# Altium schematic sheet VOLTAJE.SchDoc
size A
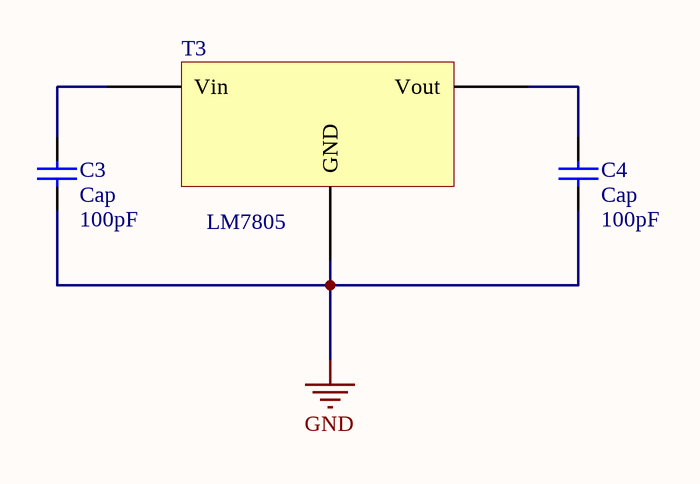
[diagram p0: VOLTAJE.SchDoc]

## Parts
C3  Cap  value 100pF  [RAD-0.3]
C4  Cap  value 100pF  [RAD-0.3]
T3  LM7805  [LM7805]

## Nets
GND: C3.1 C4.1 T3.174(GND)
NetC3_2: C3.2 T3.173(Vin)
NetC4_2: C4.2 T3.175(Vout)

## Library data of the parts
C3 C4 = Cap: Capacitor Ceramico; Manufacturer: KEMET; Manufacturer Part Number: C0402C104K8PACTU; Capacitance: 100nF; Tolerance: 10%; Voltage Rating: 10V; Dielectric: X5R; Dissipation Factor: 5%; Published: 8-Jun-2000; LatestRevisionDate: 17-Jul-2002; LatestRevisionNote: Re-released for DXP Platform.; PackageReference: RAD-0.3; Publisher: Altium Limited; PackageDescription: Radial Cap, Thru-Hole; 2 Leads; 0.3 in Pin Spacing; Supplier 1: Arrow; Stock 1: 0; Mount: PCB,Surface Mount; Case/Package: 0402; Number of Pins: 2; Case Code (Metric): 1005; Case Code (Imperial): 0402; Dielectric Material: Ceramic; Contact Plating: Matte,Tin; Min Operating Temperature: -55°C; Max Operating Temperature: 85°C; Voltage Rating (DC): 10V; Package Quantity: 1; Packaging: Tape and Reel; Termination: SMD/SMT; Voltage: 10V; Length: 1mm; Height: 0.5mm; Width: 0.02inch; Depth: 0.5mm; Thickness: 0.022inch; Lead Pitch: 0.3mm; Radiation Hardening: No; REACH SVHC: No SVHC; Lead Free: Lead Free; Supplier Part Number 1: C0402C104K8PAC7867
T3 = LM7805: Voltage Regulator; Manufacturer: ON Semiconductor / Fairchild; Manufacturer Part Number: LM7805CT; Output Voltage: 5V; Number of Outputs: 1; Max Input Voltage: 35V; Polarity: Positive; Output Type: Fixed; Output Current: 1A; Min Input Voltage: 7V; Quiescent Current: 8mA; Dropout Voltage: 2V; Accuracy: 4%; Power Supply Rejection Ratio (PSRR): 73dB; Max Output Voltage: 5.2V; Supplier 1: Newark; Stock 1: 0; Mount: Through Hole; Case/Package: TO-220-3; Number of Pins: 3; Weight: 1.214g; Min Operating Temperature: -40°C; Max Operating Temperature: 125°C; Packaging: Rail/Tube; Package Quantity: 50; Number of Regulators: 1; Output Voltage Accuracy: 4%; Max Output Current: 1A; Current Rating: 1A; Nominal Output Voltage: 5V; Min Output Voltage: 5V; Length: 10.67mm; Height: 16.3mm; Width: 4.7mm; Radiation Hardening: No; Lead Free: Lead Free; REACH SVHC: No SVHC; Supplier Part Number 1: 34C1092